# Altium schematic sheet FPGA_IO.SchDoc: FPGA I/O Interface
size 279 x 215 mm; Engineer: Prasoon Sinha; DocumentNumber: 22; SheetNumber: 22; SheetTotal: 26
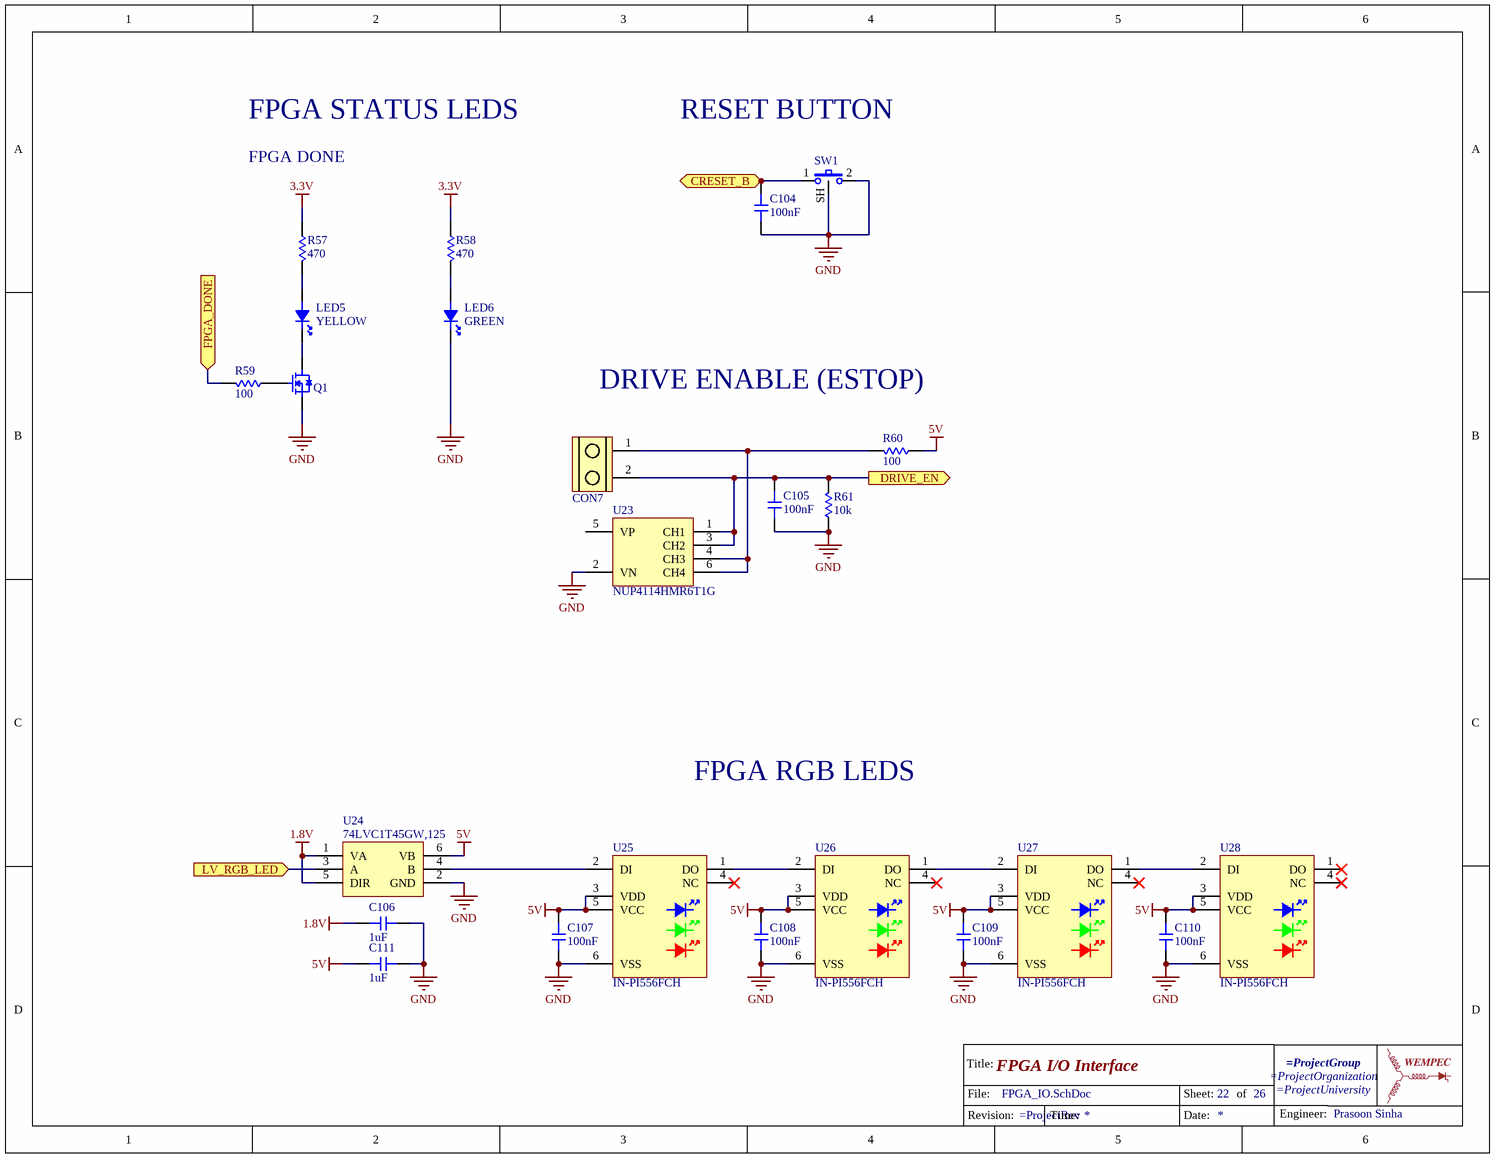
[diagram p0: FPGA_IO.SchDoc]

## Parts
*?  TitleBlockWEMPEC  (value not drawn)  (graphical)
C104  value 100nF  [0603-CAP]  (hidden comment: Capacitor)
C105  value 100nF  [0603-CAP]  (hidden comment: Capacitor)
C106  value 1uF  [0603-CAP]  (hidden comment: Capacitor)
C107  value 100nF  [0603-CAP]  (hidden comment: Capacitor)
C108  value 100nF  [0603-CAP]  (hidden comment: Capacitor)
C109  value 100nF  [0603-CAP]  (hidden comment: Capacitor)
C110  value 100nF  [0603-CAP]  (hidden comment: Capacitor)
C111  value 1uF  [0603-CAP]  (hidden comment: Capacitor)
CON7  ScrewTerminal_1x2  [1935161]  (value not drawn)
LED5  value YELLOW  [0603-LED]  (hidden comment: LED)
LED6  value GREEN  [0603-LED]  (hidden comment: LED)
Q1  MOSFET  [SOT95P245X110-3N]  (value not drawn)
R57  value 470  [0603-RES]  (hidden comment: Resistor)
R58  value 470  [0603-RES]  (hidden comment: Resistor)
R59  value 100  [0603-RES]  (hidden comment: Resistor)
R60  value 100  [0603-RES]  (hidden comment: Resistor)
R61  value 10k  [0603-RES]  (hidden comment: Resistor)
SW1  1825027-5  [1825027-5]  (value not drawn)
U23  NUP4114HMR6T1G  [TSOP95P280X110-6N]
U24  74LVC1T45GW,125  [SOT95P280X145-6N]
U25  IN-PI556FCH  [IN-PI556FCH]
U26  IN-PI556FCH  [IN-PI556FCH]
U27  IN-PI556FCH  [IN-PI556FCH]
U28  IN-PI556FCH  [IN-PI556FCH]

## Ports
CRESET_B (bidir), DRIVE_EN (out), FPGA_DONE (in), LV_RGB_LED (in)

## Nets
1.8V: C106.1 U24.1(VA) U24.5(DIR)
3.3V: R57.1 R58.1
5V: C107.2 C108.2 C109.2 C110.2 C111.1 R60.1 U24.6(VB) U25.3(VDD) U25.5(VCC) U26.3(VDD) U26.5(VCC) U27.3(VDD) U27.5(VCC) U28.3(VDD) U28.5(VCC)
GND: C104.1 C105.1 C106.2 C107.1 C108.1 C109.1 C110.1 C111.2 LED6.C Q1.2(S) R61.1 SW1.2 SW1.SH U23.2(VN) U24.2(GND) U25.6(VSS) U26.6(VSS) U27.6(VSS) U28.6(VSS)
CRESET_B: C104.2 SW1.1 ; port CRESET_B
DRIVE_EN: C105.2 CON7.2 R61.2 U23.1(CH1) U23.3(CH2) ; port DRIVE_EN
FPGA_DONE: R59.2 ; port FPGA_DONE
LV_RGB_LED: U24.3(A) ; port LV_RGB_LED
NetCON7_1: CON7.1 R60.2 U23.4(CH3) U23.6(CH4)
NetLED5_A: LED5.A R57.2
NetLED5_C: LED5.C Q1.3(D)
NetLED6_A: LED6.A R58.2
NetQ1_1: Q1.1(G) R59.1
NetU24_4: U24.4(B) U25.2(DI)
NetU25_1: U25.1(DO) U26.2(DI)
NetU26_1: U26.1(DO) U27.2(DI)
NetU27_1: U27.1(DO) U28.2(DI)

Not connected (* = marked no-connect by the designer): U23 5(VP); U25 4(NC)*; U26 4(NC)*; U27 4(NC)*; U28 1(DO)* 4(NC)*

## Notes on the sheet
- FPGA STATUS LEDS
- FPGA DONE
- RESET BUTTON
- DRIVE ENABLE (ESTOP)
- FPGA RGB LEDS
- (in symbol TitleBlockWEMPEC) Title:; File:; Sheet:; of; Engineer:; Revision:; Time:; Date:

## Library data of the parts
SW1 = 1825027-5: SWITCH TACTILE SPST-NO 0.05A 24V; Supplier 1: Digi-Key; Supplier Part Number 1: 450-1662-ND
U23 = NUP4114HMR6T1G: TVS DIODE 5.5V 10V 6TSOP; Supplier 1: Digi-Key; Supplier Part Number 1: NUP4114HMR6T1GOSCT-ND
U24 = 74LVC1T45GW,125: TXRX XLATING DUAL 3ST 6TSSOP; Supplier 1: Digi-Key; Supplier Part Number 1: 1727-4560-1-ND
U25-U28 = IN-PI556FCH: LED RGB 5050 SMD; Supplier 1: Digi-Key; Supplier Part Number 1: 1830-1107-1-ND
C104-C111 = Capacitor: Supplier 1: Digi-Key
  C104 C105 C107-C110: Supplier Part Number 1: 1276-1012-1-ND
  C106 C111: Supplier Part Number 1: 1276-6524-1-ND
CON7 = ScrewTerminal_1x2: Supplier 1: Digi-Key; Supplier Part Number 1: 277-1667-ND
LED5 LED6 = LED: Supplier 1: Digi-Key
  LED5: Supplier Part Number 1: 160-1448-1-ND
  LED6: Supplier Part Number 1: 160-1446-1-ND
Q1 = MOSFET: Supplier 1: Digi-Key; Supplier Part Number 1: FDV301NCT-ND
R57-R61 = Resistor: Supplier 1: Digi-Key
  R57 R58: Supplier Part Number 1: 541-4038-1-ND
  R59 R60: Supplier Part Number 1: YAG3561CT-ND
  R61: Supplier Part Number 1: P10.0KHCT-ND